# EAGLE design face (EAGLE 5.11)
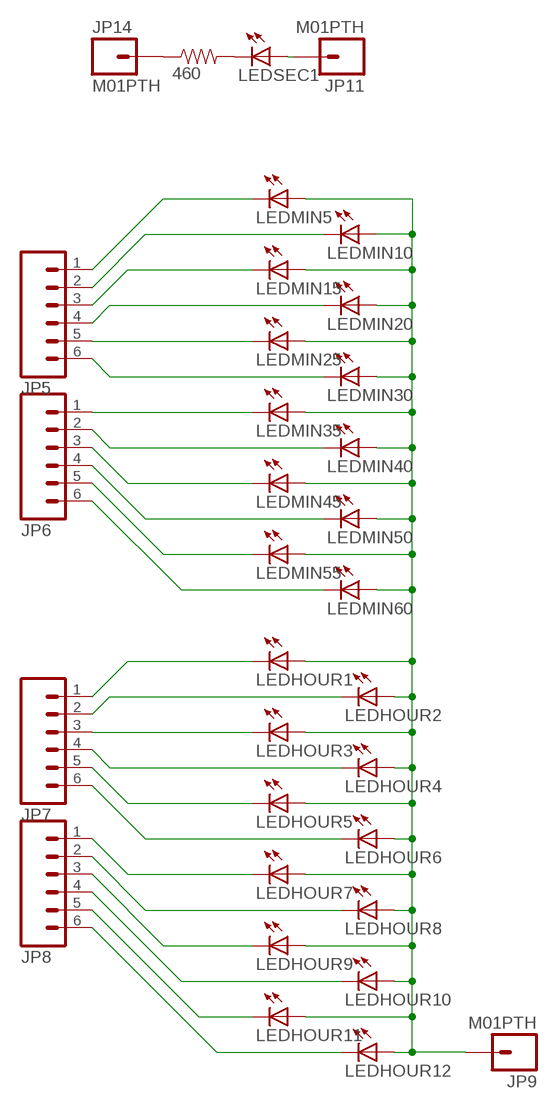
[diagram p0: schematic, sheet 1]

## Parts
JP5  M06SIP  [1X06]
JP6  M06SIP  [1X06]
JP7  M06SIP  [1X06]
JP8  M06SIP  [1X06]
JP9  M01PTH  [1X01]
JP11  M01PTH  [1X01]
JP14  M01PTH  [1X01]
LEDHOUR1  LEDCHIPLED_0805  [CHIPLED_0805]
LEDHOUR2  LEDCHIPLED_0805  [CHIPLED_0805]
LEDHOUR3  LEDCHIPLED_0805  [CHIPLED_0805]
LEDHOUR4  LEDCHIPLED_0805  [CHIPLED_0805]
LEDHOUR5  LEDCHIPLED_0805  [CHIPLED_0805]
LEDHOUR6  LEDCHIPLED_0805  [CHIPLED_0805]
LEDHOUR7  LEDCHIPLED_0805  [CHIPLED_0805]
LEDHOUR8  LEDCHIPLED_0805  [CHIPLED_0805]
LEDHOUR9  LEDCHIPLED_0805  [CHIPLED_0805]
LEDHOUR10  LEDCHIPLED_0805  [CHIPLED_0805]
LEDHOUR11  LEDCHIPLED_0805  [CHIPLED_0805]
LEDHOUR12  LEDCHIPLED_0805  [CHIPLED_0805]
LEDMIN5  LEDCHIPLED_0805  [CHIPLED_0805]
LEDMIN10  LEDCHIPLED_0805  [CHIPLED_0805]
LEDMIN15  LEDCHIPLED_0805  [CHIPLED_0805]
LEDMIN20  LEDCHIPLED_0805  [CHIPLED_0805]
LEDMIN25  LEDCHIPLED_0805  [CHIPLED_0805]
LEDMIN30  LEDCHIPLED_0805  [CHIPLED_0805]
LEDMIN35  LEDCHIPLED_0805  [CHIPLED_0805]
LEDMIN40  LEDCHIPLED_0805  [CHIPLED_0805]
LEDMIN45  LEDCHIPLED_0805  [CHIPLED_0805]
LEDMIN50  LEDCHIPLED_0805  [CHIPLED_0805]
LEDMIN55  LEDCHIPLED_0805  [CHIPLED_0805]
LEDMIN60  LEDCHIPLED_0805  [CHIPLED_0805]
LEDSEC1  LEDCHIPLED_0805  [CHIPLED_0805]
RSEC  460  RESISTOR0805-RES  [0805]

## Nets
N$8: LEDSEC1.C RSEC.2
N$16: JP6.4 LEDMIN50.C
N$32: JP5.1 LEDMIN5.C
N$33: JP5.2 LEDMIN10.C
N$34: JP5.3 LEDMIN15.C
N$35: JP5.4 LEDMIN20.C
N$36: JP5.5 LEDMIN25.C
N$37: JP5.6 LEDMIN30.C
N$38: JP6.1 LEDMIN35.C
N$39: JP6.2 LEDMIN40.C
N$40: JP6.3 LEDMIN45.C
N$41: JP6.5 LEDMIN55.C
N$42: JP6.6 LEDMIN60.C
N$43: JP7.1 LEDHOUR1.C
N$44: JP7.2 LEDHOUR2.C
N$45: JP7.3 LEDHOUR3.C
N$46: JP7.4 LEDHOUR4.C
N$47: JP7.5 LEDHOUR5.C
N$48: JP7.6 LEDHOUR6.C
N$49: JP8.1 LEDHOUR7.C
N$50: JP8.2 LEDHOUR8.C
N$51: JP8.3 LEDHOUR9.C
N$52: JP8.4 LEDHOUR10.C
N$53: JP8.5 LEDHOUR11.C
N$54: JP8.6 LEDHOUR12.C
N$55: JP11.1 LEDSEC1.A
N$61: JP14.1 RSEC.1
VCCTOP: JP9.1 LEDHOUR1.A LEDHOUR2.A LEDHOUR3.A LEDHOUR4.A LEDHOUR5.A LEDHOUR6.A LEDHOUR7.A LEDHOUR8.A LEDHOUR9.A LEDHOUR10.A LEDHOUR11.A LEDHOUR12.A LEDMIN5.A LEDMIN10.A LEDMIN15.A LEDMIN20.A LEDMIN25.A LEDMIN30.A LEDMIN35.A LEDMIN40.A LEDMIN45.A LEDMIN50.A LEDMIN55.A LEDMIN60.A

## Library data of the parts
JP5-JP8 = SparkFun:M06: Header 6 Standard 6-pin 0.1" header. Use with straight break away headers (SKU : PRT-00116), right angle break away headers (PRT-00553), swiss pins (PRT-00743), machine pins (PRT-00117), and female headers (PRT-00115). Molex polarized connector foot print use with SKU : PRT-08094 with associated crimp pins and housings. NOTES ON THE VARIANTS LOCK and LOCK_LONGPADS... This footprint was designed to help hold the alignment of a through-hole component (i.e. 6-pin header) while soldering it into place. You may notice that each hole has been shifted either up or down by 0.005 of an inch from it's more standard position (which is a perfectly straight line). This slight alteration caused the pins (the squares in the middle) to touch the edges of the holes. Because they are alternating, it causes a "brace" to hold the component in place. 0.005 has proven to be the perfect amount of "off-center" position when using our standard breakaway headers. Although looks a little odd when you look at the bare footprint, once you have a header in there, the alteration is very hard to notice. Also, if you push a header all the way into place, it is covered up entirely on the bottom side. This idea of altering the position of holes to aid alignment will be further integrated into the Sparkfun Library for other footprints. It can help hold any component with 3 or more connection pins.
JP9 JP11 JP14 = SparkFun:M01: Header 1 Standard 1-pin 0.1" header. Use with straight break away headers (SKU : PRT-00116), right angle break away headers (PRT-00553), swiss pins (PRT-00743), machine pins (PRT-00117), and female headers (PRT-00115).
LEDHOUR1-LEDHOUR12 LEDMIN5 LEDMIN10 LEDMIN15 LEDMIN20 LEDMIN25 LEDMIN30 LEDMIN35 LEDMIN40 LEDMIN45 LEDMIN50 LEDMIN55 LEDMIN60 LEDSEC1 = led:LED: LED OSRAM: - CHIPLED LG R971, LG N971, LY N971, LG Q971, LY Q971, LO R971, LY R971 LH N974, LH R974 LS Q976, LO Q976, LY Q976 LO Q996 - Hyper CHIPLED LW Q18S LB Q993, LB Q99A, LB R99A - SideLED LS A670, LO A670, LY A670, LG A670, LP A670 LB A673, LV A673, LT A673, LW A673 LH A674 LY A675 LS A676, LA A676, LO A676, LY A676, LW A676 LS A679, LY A679, LG A679 - Hyper Micro SIDELED® LS Y876, LA Y876, LO Y876, LY Y876 LT Y87S - SmartLED LW L88C, LW L88S LB L89C, LB L89S, LG L890 LS L89K, LO L89K, LY L89K LS L896, LA L896, LO L896, LY L896 - TOPLED LS T670, LO T670, LY T670, LG T670, LP T670 LSG T670, LSP T670, LSY T670, LOP T670, LYG T670 LG T671, LOG T671, LSG T671 LB T673, LV T673, LT T673, LW T673 LH T674 LS T676, LA T676, LO T676, LY T676, LB T676, LH T676, LSB T676, LW T676 LB T67C, LV T67C, LT T67C, LS T67K, LO T67K, LY T67K, LW E67C LS E67B, LA E67B, LO E67B, LY E67B, LB E67C, LV E67C, LT E67C LW T67C LS T679, LY T679, LG T679 LS T770, LO T770, LY T770, LG T770, LP T770 LB T773, LV T773, LT T773, LW T773 LH T774 LS E675, LA E675, LY E675, LS T675 LS T776, LA T776, LO T776, LY T776, LB T776 LHGB T686 LT T68C, LB T68C - Hyper Mini TOPLED® LB M676 - Mini TOPLED Santana® LG M470 LS M47K, LO M47K, LY M47K Source: http://www.osram.convergy.de LUXEON: - LUMILED® LXK2-PW12-R00, LXK2-PW12-S00, LXK2-PW14-U00, LXK2-PW14-V00 LXK2-PM12-R00, LXK2-PM12-S00, LXK2-PM14-U00 LXK2-PE12-Q00, LXK2-PE12-R00, LXK2-PE12-S00, LXK2-PE14-T00, LXK2-PE14-U00 LXK2-PB12-K00, LXK2-PB12-L00, LXK2-PB12-M00, LXK2-PB14-N00, LXK2-PB14-P00, LXK2-PB14-Q00 LXK2-PR12-L00, LXK2-PR12-M00, LXK2-PR14-Q00, LXK2-PR14-R00 LXK2-PD12-Q00, LXK2-PD12-R00, LXK2-PD12-S00 LXK2-PH12-R00, LXK2-PH12-S00 LXK2-PL12-P00, LXK2-PL12-Q00, LXK2-PL12-R00 Source: www.luxeon.com KINGBRIGHT: KA-3528ASYC Source: www.kingbright.com
RSEC = SparkFun:RESISTOR: Resistor Basic schematic elements and footprints for 0603, 1206, and PTH resistors.

## Board
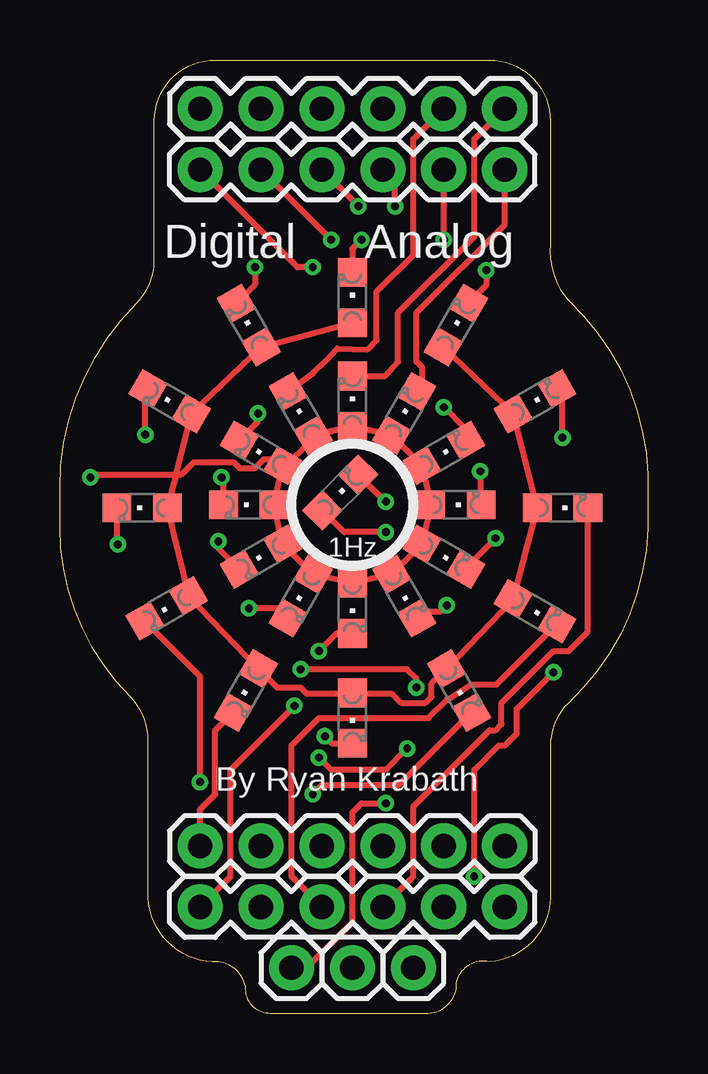
[diagram p1: board, top side]
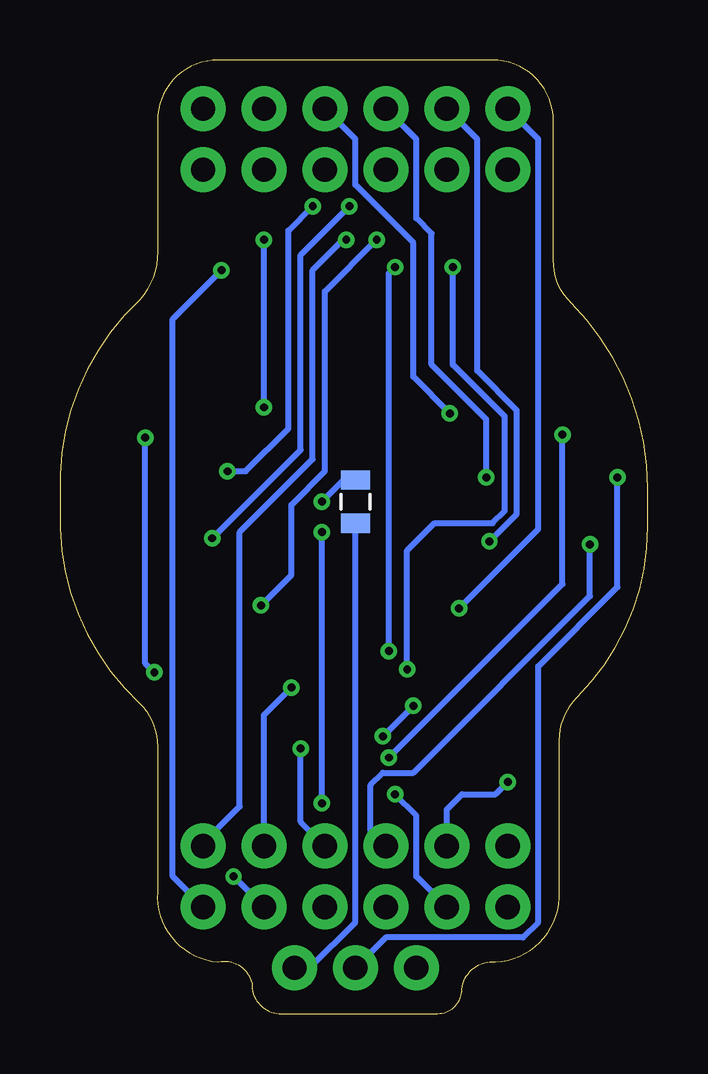
[diagram p2: board, bottom side, seen from below]

Size 24.51 x 39.75 mm. Coordinates in mm from the lower left corner, seen from the top.
Outline: 0,21.9 arc-45 3.19,29.61 arc45 3.94,31.41 3.94,37.21 arc-90 6.48,39.75 17.91,39.75 arc-90 20.45,37.21 20.45,32.04 arc45 21.19,29.74 arc-45 24.51,22.46 24.51,20.21 arc-45 21.19,12.94 arc45 20.45,11.14 20.45,5.08 arc-90 17.91,2.16 arc90 16.51,1.27 arc-90 15.37,0 8.76,0 arc-90 7.75,1.02 arc90 6.35,2.16 arc-90 3.68,5.08 3.68,11.39 arc45 2.94,13.19 arc-45 0,20.29 0,21.9
Copper layers (1*16): Top 0.0356mm / dielectric 1.5011mm / Bottom 0.0356mm
Design rules "LaenPCBOrder *": minimum track width 6mil, minimum drill 13mil, track to track 6mil, track to pad 6mil, pad to pad 6mil, via to via 6mil, smd to smd 6mil, copper to edge 15mil, drill to drill 6mil, minimum pad ring 7mil, minimum via ring 7mil, stop-mask expansion 4mil, vias tented up to drill 14mil, thermal gap 10mil

### Footprints (pad centres in the part's own frame; a part is rotated, then mirrored left to right if it is on the bottom)
1X06 = drill 1.016 pad 1.88 round: 1 0,0; 2 2.54,0; 3 5.08,0; 4 7.62,0; 5 10.16,0; 6 12.7,0
1X01 = drill 1.016 pad 1.88 round: 1 0,0
CHIPLED_0805 = smd 1.2 x 1.2: A 0,-1.05; C 0,1.05
0805 = smd 0.8 x 1.2: 1 -0.9,0; 2 0.9,0

### Placement (x,y rotation side)
JP5  18.54,4.45 180 top
JP6  5.84,6.99 0 top
JP7  18.54,35.18 180 top
JP8  5.84,37.72 0 top
JP9  12.19,1.91 0 top
JP11  9.65,1.91 0 top
JP14  14.73,1.91 0 top
LEDHOUR1  14.35,25.02 330 top
LEDHOUR2  16,23.37 300 top
LEDHOUR3  16.51,21.21 270 top
LEDHOUR4  16,19.05 240 top
LEDHOUR5  14.35,17.4 210 top
LEDHOUR6  12.19,16.89 180 top
LEDHOUR7  10.03,17.4 150 top
LEDHOUR8  8.38,19.05 120 top
LEDHOUR9  7.87,21.21 90 top
LEDHOUR10  8.38,23.37 60 top
LEDHOUR11  10.03,25.02 30 top
LEDHOUR12  12.19,25.53 0 top
LEDMIN5  16.51,28.7 330 top
LEDMIN10  19.81,25.53 300 top
LEDMIN15  20.95,21.08 270 top
LEDMIN20  19.81,16.76 240 top
LEDMIN25  16.64,13.46 210 top
LEDMIN30  12.19,12.32 180 top
LEDMIN35  7.75,13.46 150 top
LEDMIN40  4.45,16.89 120 top
LEDMIN45  3.43,21.08 90 top
LEDMIN50  4.57,25.53 60 top
LEDMIN55  7.87,28.7 30 top
LEDMIN60  12.19,29.84 0 top
LEDSEC1  11.68,21.72 315 top
RSEC  12.19,21.34 90 bottom

### Tracks (layer width: path | path; a pad name or v marks a point on that pad's centre or on a via)
N$8  (via drill 0.33)
  Top 0.254: 12.85,22.33 LEDSEC1.C 13.55,21.34 v13.59,21.34
  Bottom 0.254: v13.59,21.34 12.69,22.24 RSEC.2
N$16  (via drill 0.33)
  Top 0.254: LEDMIN50.C 3.56,25.95 v3.56,24.13 | v10.79,10.67 11.3,10.16 13.59,10.16 v14.48,11.05
  Bottom 0.254: v3.56,24.13 3.56,17.91 v10.79,10.67 | v14.48,11.05 14.48,8 JP6.4
N$32  (via drill 0.33)
  Top 0.254: v17.78,30.99 17.78,30.36 LEDMIN5.C
  Bottom 0.254: v17.78,30.99 19.81,28.96 19.81,5.71 JP5.1
N$33  (via drill 0.33)
  Top 0.254: v17.27,5.71 17.27,10.16 18.29,11.18 18.54,11.18 19.05,11.68 19.05,12.7 v20.57,14.22 | v20.95,24 20.95,25.82 LEDMIN10.C
  Bottom 0.254: JP5.2 v17.27,5.71 | v20.57,14.22 20.95,14.61 v20.95,24
N$34
  Top 0.254: JP5.3 14.73,5.71 14.73,8.64 17.91,11.81 18.16,11.81 18.41,12.06 18.41,12.95 20.57,15.11 21.21,15.11 22,15.91 LEDMIN15.C
N$35
  Top 0.254: JP5.4 9.65,5.71 9.65,11.18 10.79,12.32 15.37,12.32 16.13,13.08 17.14,13.72 18.2,13.72 LEDMIN20.C
N$36  (via drill 0.33)
  Top 0.254: v10.54,9.14 10.92,9.53 14.13,9.53 LEDMIN25.C
  Bottom 0.254: JP5.5 9.65,5.71 9.65,8.26 v10.54,9.14
N$37  (via drill 0.33)
  Top 0.254: LEDMIN30.C 11.34,11.27 v11.05,11.56 | v9.78,12.83 7.11,10.16 7.11,5.71 JP5.6
  Bottom 0.254: v9.78,12.83 v11.05,11.56
N$38
  Top 0.254: LEDMIN35.C 6.48,11.81 6.48,9.14 5.84,8.51 JP6.1
N$39  (via drill 0.33)
  Top 0.254: LEDMIN40.C 5.84,14.06 v5.84,9.65
  Bottom 0.254: v5.84,9.65 6.35,9.14 7.75,9.14 8.38,8.51 JP6.2
N$40  (via drill 0.33)
  Top 0.254: LEDMIN45.C 2.38,19.59 v2.41,19.56
  Bottom 0.254: v2.41,19.56 2.41,17.4 9.78,10.03 11.05,10.03 11.56,9.53 11.56,7.62 JP6.3
N$41  (via drill 0.33)
  Top 0.254: LEDMIN55.C 8.13,30.39 v8.13,31.11 | v10.03,14.35 14.48,14.35 14.86,13.97 v14.86,13.59
  Bottom 0.254: v8.13,31.11 8.13,27.05 5.97,24.89 5.97,20.95 6.48,20.45 8.89,20.45 10.03,19.3 v10.03,14.35 | v14.86,13.59 16,12.45 JP6.5
N$42  (via drill 0.33)
  Top 0.254: LEDMIN60.C 12.19,31.88 v12.57,32.26
  Bottom 0.254: v12.57,32.26 12.7,32.26 13.97,30.99 13.97,23.11 17.02,20.07 17.02,8.64 18.54,7.11 JP6.6
N$43
  Top 0.254: JP7.1 18.54,32.89 14.86,29.21 14.86,27.18 15.11,26.92 15.11,26.42 14.88,26.18 LEDHOUR1.C
N$44  (via drill 0.33)
  Top 0.254: v16,32.26 JP7.2 | v16,25.27 16.91,24.36 LEDHOUR2.C
  Bottom 0.254: v16,25.27 v16,32.26
N$45  (via drill 0.33)
  Top 0.254: JP7.3 13.97,34.67 v13.97,33.66 | v17.53,22.61 17.56,22.57 LEDHOUR3.C
  Bottom 0.254: v13.97,33.66 14.99,32.64 14.99,24.38 16.76,22.61 v17.53,22.61
N$46  (via drill 0.33)
  Top 0.254: v12.45,33.66 JP7.4 | v18.16,19.81 16.91,18.56 LEDHOUR4.C
  Bottom 0.254: v12.45,33.66 14.48,31.62 14.48,23.5 v18.16,19.81
N$47  (via drill 0.33)
  Top 0.254: v11.3,32.26 JP7.5 | v16.13,17.02 15.88,16.76 15.37,16.76 15.09,16.49 LEDHOUR5.C
  Bottom 0.254: v11.3,32.26 13.46,30.1 13.46,22.61 14.86,21.21 14.86,18.29 v16.13,17.02
N$48  (via drill 0.33)
  Top 0.254: JP7.6 9.91,31.11 v10.54,31.11 | v10.79,15.11 11.52,15.84 LEDHOUR6.C
  Bottom 0.254: v10.54,31.11 10.79,30.86 v10.79,15.11
N$49  (via drill 0.33)
  Top 0.254: v7.87,16.89 9.11,16.89 LEDHOUR7.C
  Bottom 0.254: JP8.1 4.57,36.45 4.57,20.19 v7.87,16.89
N$50  (via drill 0.33)
  Top 0.254: v6.6,19.68 6.6,19.39 LEDHOUR8.C
  Bottom 0.254: JP8.2 7.11,36.45 7.11,26.8 5.46,25.15 5.46,20.83 v6.6,19.68
N$51  (via drill 0.33)
  Top 0.254: v6.73,22.35 6.82,22.26 LEDHOUR9.C
  Bottom 0.254: JP8.3 9.65,36.45 9.65,33.15 9.02,32.51 9.02,27.05 6.73,24.77 v6.73,22.35
N$52  (via drill 0.33)
  Top 0.254: v8.26,25.02 8.26,24.68 LEDHOUR10.C
  Bottom 0.254: v8.26,25.02 9.78,26.54 9.78,32.13 12.19,34.54 12.19,36.45 JP8.4
N$53
  Top 0.254: JP8.5 14.73,36.45 14.73,31.62 13.21,30.1 13.21,28.07 12.83,27.69 11.56,27.72 11.09,27.21 10.54,26.67 LEDHOUR11.C
N$54
  Top 0.254: JP8.6 17.27,36.45 17.27,32.38 14.1,29.21 14.1,27.18 13.55,26.58 LEDHOUR12.C
N$55  (via drill 0.33)
  Top 0.254: LEDSEC1.A 11.85,20.07 v13.59,20.07 | v13.59,8.76 12.57,8.76 12.19,8.38 12.19,3.81 10.29,1.91 JP11.1
  Bottom 0.254: v13.59,8.76 v13.59,20.07
N$61
  Bottom 0.254: RSEC.1 12.19,3.81 14.1,1.91 JP14.1
VCCTOP  (via drill 0.33)
  Top 0.254: LEDHOUR1.A LEDHOUR2.A LEDHOUR3.A LEDHOUR4.A LEDHOUR5.A LEDHOUR6.A LEDHOUR7.A LEDHOUR8.A LEDHOUR9.A LEDHOUR10.A | LEDMIN60.A LEDMIN55.A LEDMIN50.A 4.83,22.47 | 4.83,22.47 LEDMIN45.A LEDMIN40.A LEDMIN35.A 9.05,13.59 10.03,13.59 10.29,13.34 12.16,13.34 | LEDMIN5.A LEDMIN10.A LEDMIN15.A LEDMIN20.A LEDMIN25.A 15.49,13.75 15.49,13.21 15.24,12.95 14.22,12.95 13.84,13.34 12.16,13.34 | 12.16,13.34 LEDMIN30.A | v1.27,22.35 1.39,22.47 4.83,22.47 | LEDHOUR1.A LEDHOUR12.A LEDHOUR11.A | LEDHOUR1.A 12.06,24.51 12.19,24.38 12.19,24.51 10.79,24.13 9.27,22.73 8.89,23.11 8.51,23.11 8.13,22.73 7.49,22.73 7.24,22.99 5.59,22.99 5.08,22.47 4.83,22.47
  Bottom 0.254: JP9.1 10.92,3.17 5.21,3.17 4.57,3.81 4.57,14.48 1.27,17.78 v1.27,22.35

### Text on the board
_tsilk: Digital | Analog | 1Hz | By Ryan Krabath